# EAGLE design tb6560-2 (EAGLE 5.11)
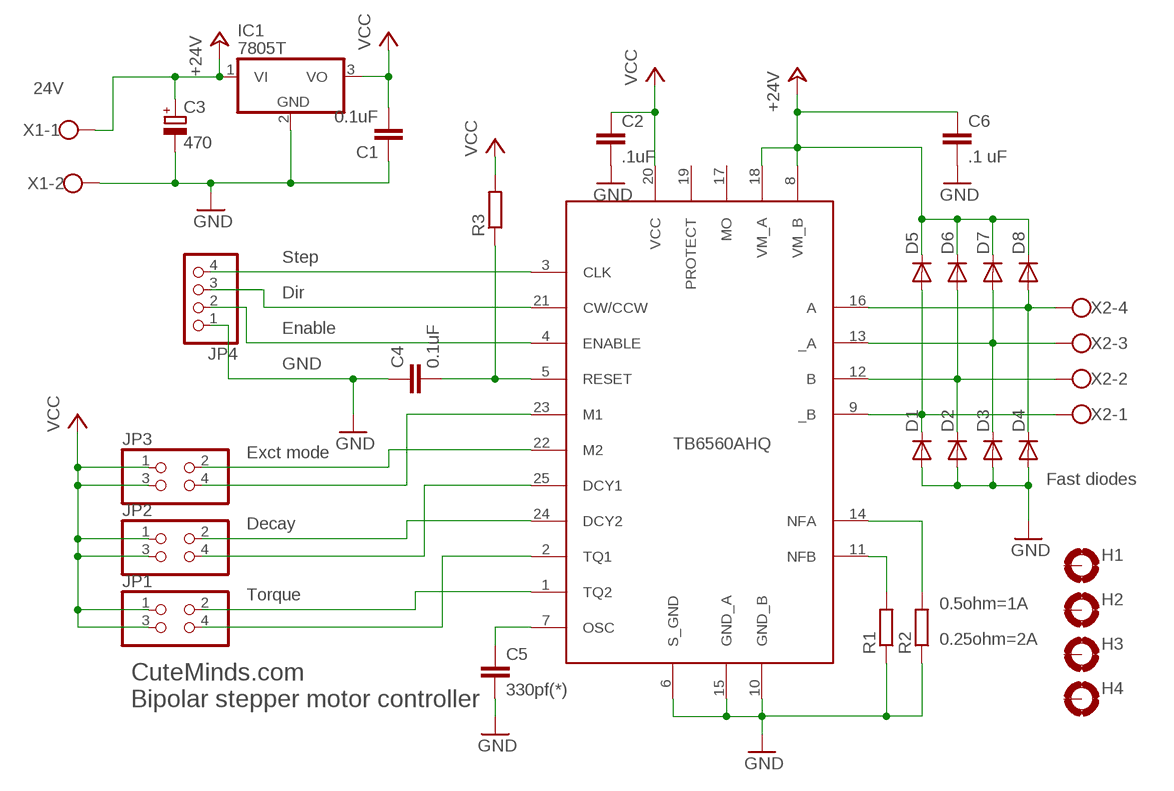
[diagram p0: schematic, sheet 1]

## Parts
C1  0.1uF  C-EU025-025X050  [C025-025X050]
C2  .1uF  C2.5/2  [C2.5-2]
C3  470  CPOL-EUE5-10.5  [E5-10,5]
C4  0.1uF  C-EU025-025X050  [C025-025X050]
C5  330pf(*)  C-EU025-025X050  [C025-025X050]
C6  .1 uF  C2.5/2  [C2.5-2]
D1  1N4148DO35-10  [DO35-10]
D2  1N4148DO35-10  [DO35-10]
D3  1N4148DO35-10  [DO35-10]
D4  1N4148DO35-10  [DO35-10]
D5  1N4148DO35-10  [DO35-10]
D6  1N4148DO35-10  [DO35-10]
D7  1N4148DO35-10  [DO35-10]
D8  1N4148DO35-10  [DO35-10]
H1  MOUNT-PAD-ROUND3.0  [3,0-PAD]
H2  MOUNT-PAD-ROUND3.0  [3,0-PAD]
H3  MOUNT-PAD-ROUND3.0  [3,0-PAD]
H4  MOUNT-PAD-ROUND3.0  [3,0-PAD]
IC1  7805T  [TO220H]
JP1  PINHD-2X2  [2X02]
JP2  PINHD-2X2  [2X02]
JP3  PINHD-2X2  [2X02]
JP4  PINHD-1X4  [1X04]
R1  R-EU_0617/17  [0617/17]
R2  R-EU_0617/17  [0617/17]
R3  R-EU_0207/10  [0207/10]
U$1  TB6560  [ZIP25]
X1  W237-102  [W237-102]
X2  W237-4  [W237-4]

## Nets
+24V: C3.+ C6.1 D5.C D6.C D7.C D8.C IC1.1(VI) U$1.8(VM_B) U$1.18(VM_A) X1.1
GND: C1.1 C2.2 C3.- C4.1 C5.2 C6.2 D1.A D2.A D3.A D4.A IC1.2(GND) JP4.1 R1.1 R2.1 U$1.6(S_GND) U$1.10(GND_B) U$1.15(GND_A) X1.2
N$1: R1.2 U$1.11(NFB)
N$2: R2.2 U$1.14(NFA)
N$3: D4.C D8.A U$1.16(A) X2.4
N$4: D3.C D7.A U$1.13(_A) X2.3
N$5: D2.C D6.A U$1.12(B) X2.2
N$6: D1.C D5.A U$1.9(_B) X2.1
N$13: C5.1 U$1.7(OSC)
N$16: JP3.4 U$1.23(M1)
N$17: JP3.2 U$1.22(M2)
N$18: JP2.4 U$1.25(DCY1)
N$19: JP2.2 U$1.24(DCY2)
N$20: JP1.4 U$1.2(TQ1)
N$21: JP1.2 U$1.1(TQ2)
N$22: JP4.4 U$1.3(CLK)
N$23: JP4.3 U$1.21(CW/CCW)
N$24: JP4.2 U$1.4(ENABLE)
N$25: C4.2 R3.1 U$1.5(RESET)
VCC: C1.2 C2.1 IC1.3(VO) JP1.1 JP1.3 JP2.1 JP2.3 JP3.1 JP3.3 R3.2 U$1.20(VCC)
Unconnected: H1.B3,0(MOUNT) H2.B3,0(MOUNT) H3.B3,0(MOUNT) H4.B3,0(MOUNT) U$1.17(MO) U$1.19(PROTECT)

## Notes on the sheet
- 24V
- Step
- Dir
- Enable
- GND
- TB6560AHQ
- Exct mode
- Fast diodes
- Decay
- Torque
- 0.5ohm=1A
- 0.25ohm=2A
- CuteMinds.com
- Bipolar stepper motor controller

## Library data of the parts
C1 C4 C5 = CNC-Components:C-EU: CAPACITOR, European symbol
C2 C6 = capacitor-wima:C: CAPACITOR naming: grid - package width
C3 = rcl:CPOL-EU: POLARIZED CAPACITOR, European symbol
D1-D8 = diode:1N4148: DIODE high speed (Philips)
H1-H4 = holes:MOUNT-PAD-ROUND: MOUNTING PAD, round
IC1 = linear:78*: Positive VOLTAGE REGULATOR Source: http://cache.national.com/ds/LM/LM78L05.pdf http://www.fairchildsemi.com/ds/LM/LM7805.pdf
JP1-JP3 = pinhead:PINHD-2X2: PIN HEADER
JP4 = pinhead:PINHD-1X4: PIN HEADER
R1 R2 = CNC-Components:R-EU_: RESISTOR, European symbol
R3 = rcl:R-EU_: RESISTOR, European symbol
U$1 = TB6560:TB6560
X1 = con-wago-500:W237-102: WAGO SCREW CLAMP; MPN: 237-102; OC_FARNELL: unknown; OC_NEWARK: 70K9898
X2 = con-wago-500:W237-4: WAGO SCREW CLAMP; OC_FARNELL: unknown; OC_NEWARK: unknown

## Net classes
0 default: clearance 0.635 mm

## Board
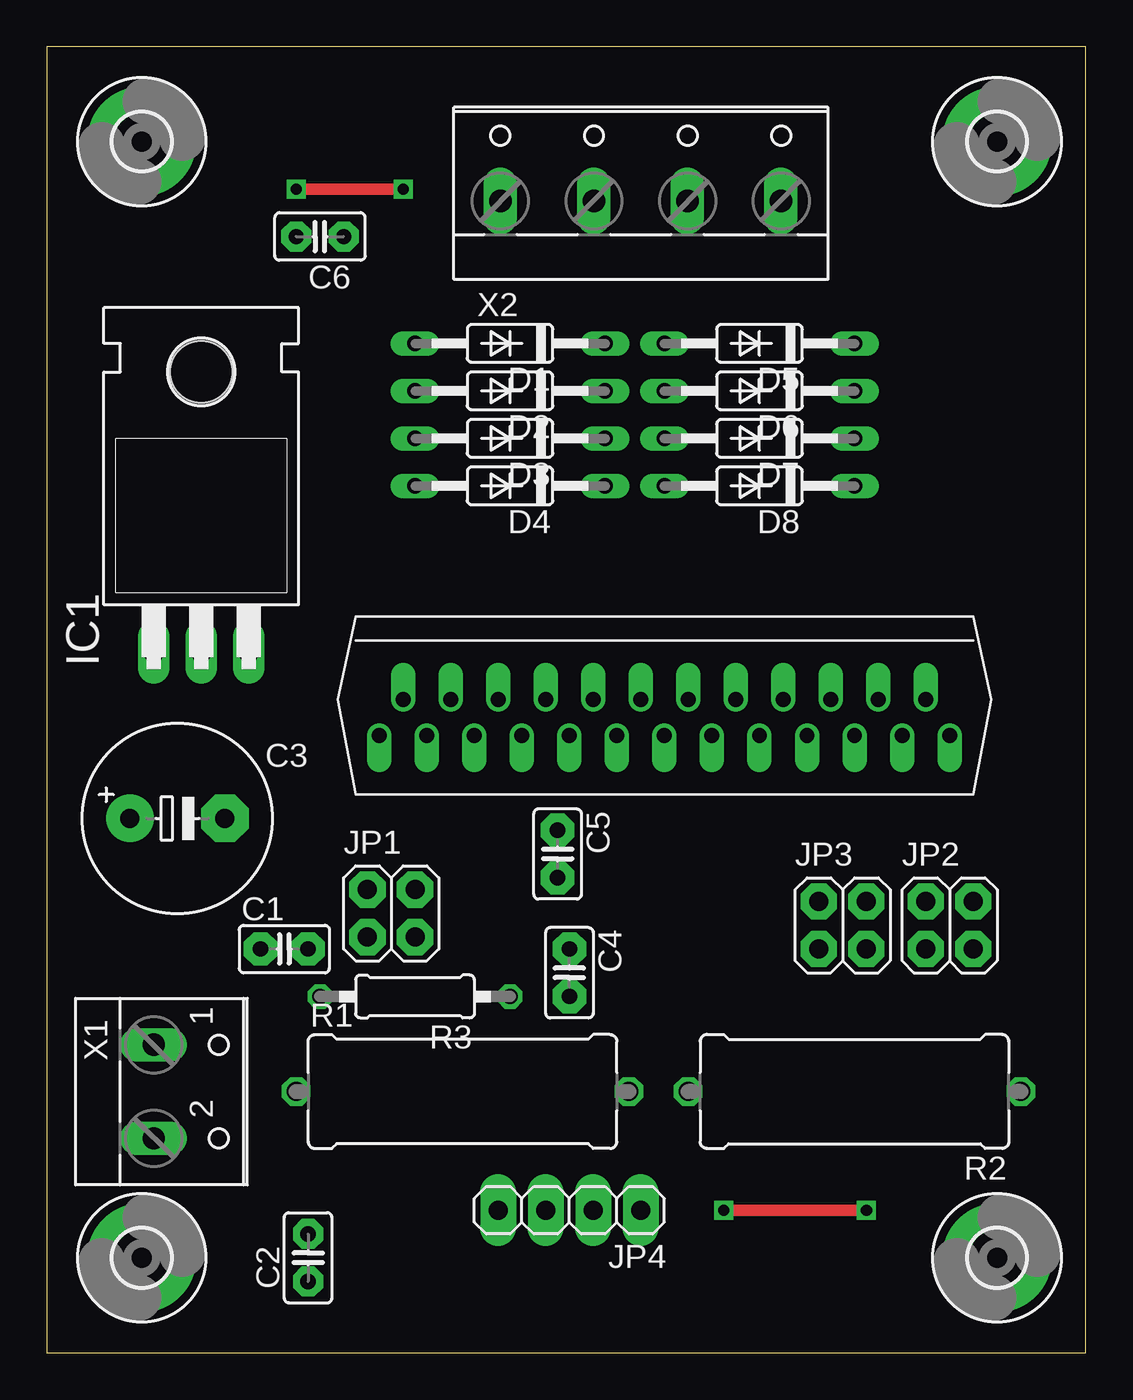
[diagram p1: board, top side]
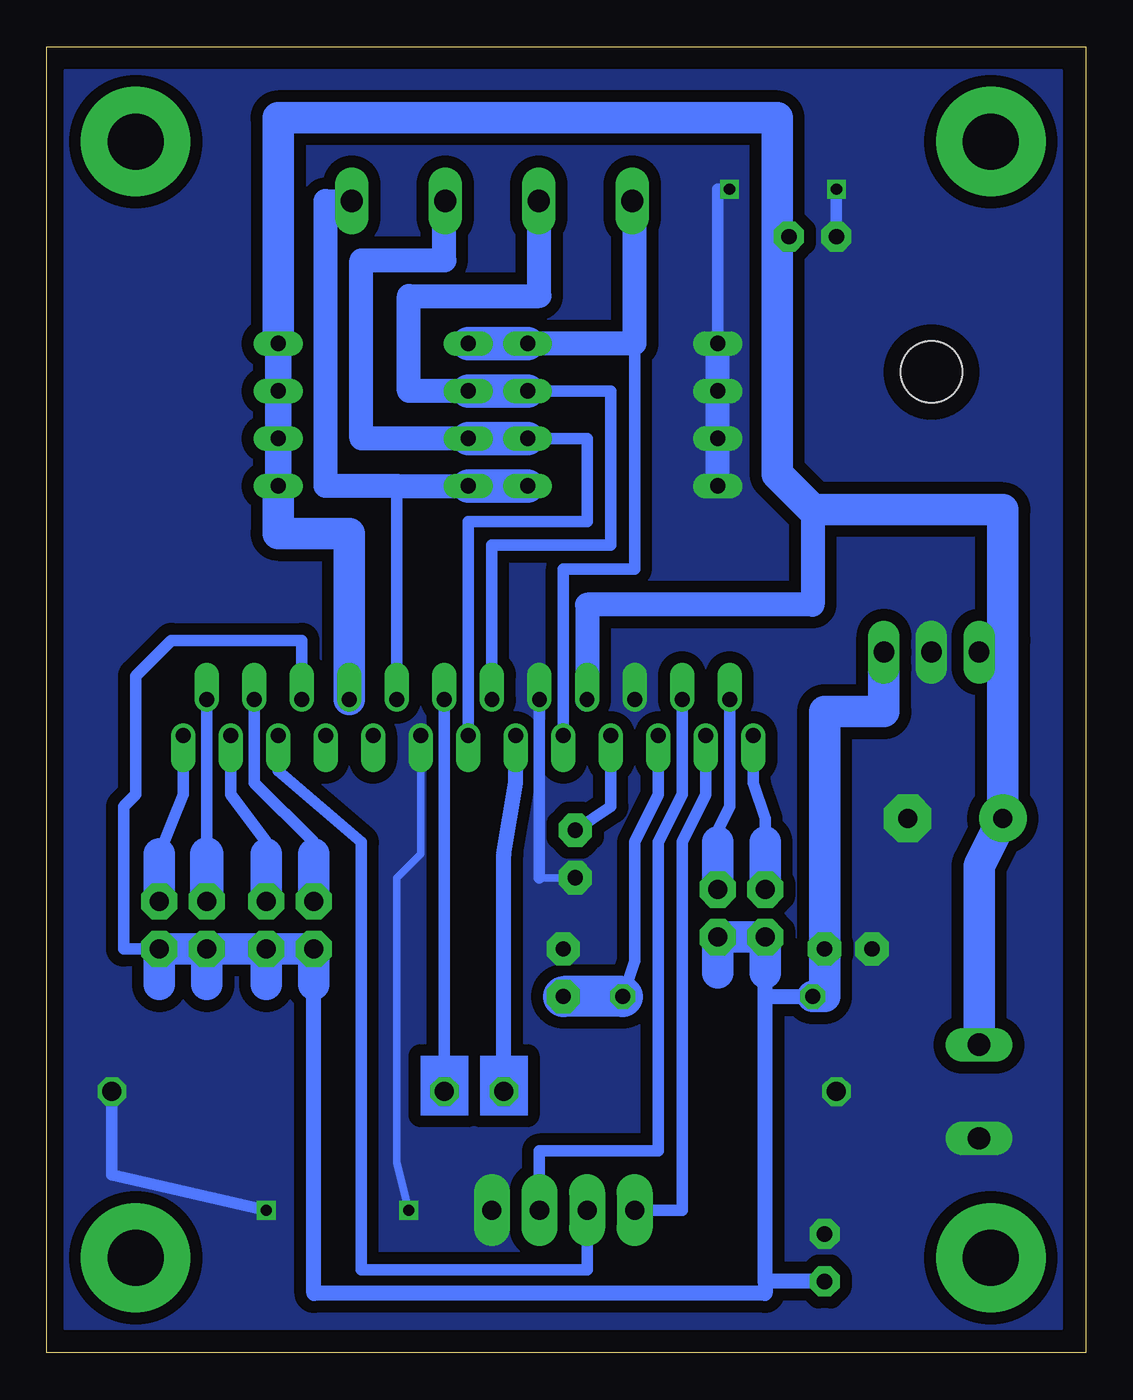
[diagram p2: board, bottom side, seen from below]

Size 55.55 x 69.84 mm. Coordinates in mm from the lower left corner, seen from the top.
Outline: 0,0 55.55,0 55.55,69.84 0,69.84 0,0
Copper layers (1*16): Top 0.035mm / dielectric 1.5mm / Bottom 0.035mm
Design rules "default *": minimum track width 10mil, minimum drill 24mil, track to track 8mil, track to pad 8mil, pad to pad 8mil, via to via 8mil, smd to smd 8mil, copper to edge 24mil, drill to drill 8mil, minimum pad ring 10mil, minimum via ring 8mil, stop-mask expansion 4mil, vias tented up to drill 0mil, thermal gap 10mil

### Footprints (pad centres in the part's own frame; a part is rotated, then mirrored left to right if it is on the bottom)
C025-025X050 = drill 0.813 pad 1.778 octagon: 1 -1.27,0; 2 1.27,0
C2.5-2 = drill 0.813 pad 1.6 octagon: 1 -1.27,0; 2 1.27,0
E5-10,5 = drill 1.016 pad 2.54 round: + -2.54,0 | drill 1.016 pad 2.54 octagon: - 2.54,0
DO35-10 = drill 0.813 long: A 5.08,0; C -5.08,0
3,0-PAD = drill 3 pad 5.842 round: B3,0 0,0
TO220H = drill 1.118 long: 1 -2.54,-10.16; 2 0,-10.16; 3 2.54,-10.16 | hole 3.302: 0,4.826
2X02 = drill 1.016 pad 1.93 octagon: 1 -1.27,-1.27; 2 -1.27,1.27; 3 1.27,-1.27; 4 1.27,1.27
1X04 = drill 1.016 pad 1.93 long: 1 -3.81,0; 2 -1.27,0; 3 1.27,0; 4 3.81,0
0617/17 = drill 1.016 octagon: 1 -8.89,0; 2 8.89,0
0207/10 = drill 0.813 octagon: 1 -5.08,0; 2 5.08,0
ZIP25 = drill 0.8 pad 1.27 offset: 1 -15.24,-1.27; 2 -13.97,0.635; 3 -12.7,-1.27; 4 -11.43,0.635; 5 -10.16,-1.27; 6 -8.89,0.635; 7 -7.62,-1.27; 8 -6.35,0.635; 9 -5.08,-1.27; 10 -3.81,0.635; 11 -2.54,-1.27; 12 -1.27,0.635; 13 0,-1.27; 14 1.27,0.635; 15 2.54,-1.27; 16 3.81,0.635; 17 5.08,-1.27; 18 6.35,0.635; 19 7.62,-1.27; 20 8.89,0.635; 21 10.16,-1.27; 22 11.43,0.635; 23 12.7,-1.27; 24 13.97,0.635; 25 15.24,-1.27
W237-102 = drill 1.194 long: 1 -2.5,-1.27; 2 2.5,-1.27
W237-4 = drill 1.194 long: 1 -7.5,-1.27; 2 -2.5,-1.27; 3 2.5,-1.27; 4 7.5,-1.27

### Placement (x,y rotation side)
C1  12.7,21.59 0 top
C2  13.97,5.08 90 top
C3  6.99,28.57 0 top
C4  27.94,20.32 270 top
C5  27.3,26.67 270 top
C6  14.61,59.69 180 top
D1  24.77,53.98 180 top
D2  24.77,51.44 180 top
D3  24.77,48.9 180 top
D4  24.77,46.35 180 top
D5  38.1,53.98 180 top
D6  38.1,51.44 180 top
D7  38.1,48.9 180 top
D8  38.1,46.35 180 top
H1  5.08,64.77 0 top
H2  50.8,64.77 0 top
H3  5.08,5.08 0 top
H4  50.8,5.08 0 top
IC1  8.26,47.62 0 top
JP1  18.41,23.5 0 top
JP2  48.26,22.86 0 top
JP3  42.55,22.86 0 top
JP4  27.94,7.62 180 top
R1  22.23,13.97 0 top
R2  43.18,13.97 180 top
R3  19.68,19.05 180 top
U$1  33.02,34.29 0 top
X1  6.99,13.97 270 top
X2  31.75,62.87 0 top

### Tracks (layer width: path | path; a pad name or v marks a point on that pad's centre or on a via)
+24V
  Bottom 0.813: 16.51,59.69 C6.1
  Bottom 1.27: U$1.8 26.67,40.01 14.61,40.01 14.61,45.09
  Bottom 1.422: D5.C D6.C D7.C D8.C
  Bottom 1.676: 4.45,38.1 IC1.1 | 4.45,38.1 4.45,45.09 14.61,45.09 16.51,46.99 16.51,59.69 16.51,66.04 43.18,66.04 D5.C | D8.C 43.18,43.81 39.37,43.81 U$1.18 | 4.45,38.1 C3.+ 5.71,26.04 X1.1
GND  (via drill 0.6, 0.6 pad 0.81)
  Top 0.61: v36.2,7.62 v43.81,7.62 | v19.05,62.23 v13.34,62.23
  Bottom 0.406: C5.2 29.21,25.4 | U$1.15 35.56,26.67 36.83,25.4 36.83,10.16 v36.2,7.62
  Bottom 0.61: v43.81,7.62 52.07,9.53 R2.1 | 29.21,25.4 U$1.10 | D1.A 19.68,62.23 v19.05,62.23 | v13.34,62.23 C6.2
  Bottom 1.27: D4.A D3.A D2.A D1.A
  pour Bottom (no thermals): 1.27,68.58 54.61,68.58 54.61,1.27 1.27,1.27
N$1
  Bottom 0.813: U$1.11 30.48,30.48 31.11,26.67 R1.2
N$2
  Bottom 0.61: R2.2 U$1.14
N$3
  Bottom 0.61: U$1.16 36.83,46.35
  Bottom 1.27: X2.4 40.64,61.59 40.64,46.35 36.83,46.35 D8.A
  Bottom 1.778: D8.A D4.C
N$4
  Bottom 0.61: U$1.13 33.02,44.45 26.67,44.45 26.67,48.9 D3.C
  Bottom 1.27: X2.3 34.29,61.59 34.29,58.42 38.73,58.42 38.73,48.9 D7.A
  Bottom 1.778: D3.C D7.A
N$5
  Bottom 0.61: U$1.12 31.75,43.18 25.4,43.18 25.4,51.44 D2.C
  Bottom 1.27: X2.2 29.21,61.59 29.21,56.52 36.2,56.52 36.2,51.44 D6.A
  Bottom 1.778: D2.C D6.A
N$6
  Bottom 0.61: U$1.9 27.94,41.91 24.13,41.91 24.13,53.98
  Bottom 1.27: X2.1 24.13,61.59 24.13,53.98 D1.C
  Bottom 1.778: D1.C D5.A
N$13
  Bottom 0.61: C5.1 25.4,29.21 U$1.7
N$16
  Bottom 0.61: U$1.23 45.72,29.84 43.81,27.3 43.81,26.67
  Bottom 1.676: JP3.4 43.81,26.67
N$17
  Bottom 0.61: 41.27,26.67 41.27,27.3 44.45,30.48 U$1.22
  Bottom 1.676: JP3.2 41.27,26.67
N$18
  Bottom 0.61: 49.53,26.67 48.26,29.84 U$1.25
  Bottom 1.676: JP2.4 49.53,26.67
N$19
  Bottom 0.61: 46.99,26.67 U$1.24
  Bottom 1.778: JP2.2 46.99,26.67
N$20
  Bottom 0.61: 19.68,27.3 19.68,27.94 19.05,29.21 U$1.2
  Bottom 1.676: JP1.4 19.68,27.3
N$21
  Bottom 0.61: U$1.1 17.78,30.48 17.14,28.57 17.14,27.3
  Bottom 1.676: JP1.2 17.14,27.3
N$22
  Bottom 0.61: U$1.3 20.32,29.84 21.59,27.3 21.59,7.62 JP4.4
N$23
  Bottom 0.61: JP4.3 26.67,4.45 38.73,4.45 38.73,27.3 43.18,31.11 U$1.21
N$24
  Bottom 0.61: JP4.2 29.21,10.79 22.86,10.79 22.86,27.3 21.59,29.84 U$1.4
N$25
  Bottom 0.61: U$1.5 22.86,29.84 24.13,27.3 24.13,20.95 R3.1
  Bottom 2.184: R3.1 C4.2
VCC
  Bottom 0.61: JP3.3 43.18,21.59 | U$1.20 41.91,38.1 48.9,38.1 50.8,36.2 50.8,29.84 51.44,29.21 51.44,21.59 JP2.3
  Bottom 0.813: 41.27,19.68 41.27,3.17 17.14,3.17 17.14,3.81 | 17.14,19.05 R3.2 | 17.14,19.05 17.14,20.32 | 17.14,3.81 17.14,19.05 | C2.1 17.14,3.81
  Bottom 1.676: 41.27,19.68 JP3.1 JP3.3 | JP3.3 43.81,19.68 | JP2.1 46.99,19.68 | 49.53,19.68 JP2.3 JP2.1 | JP3.3 JP2.1 | 17.14,20.32 JP1.1 JP1.3 19.68,20.32 | IC1.3 10.79,34.29 13.97,34.29 C1.2 13.97,19.05 R3.2
(copper drawn outside any net)
  shapes: Bottom area x2

### Text on the board
tDocu: 7805 | Step | Dir | Enbl | Gnd